# EAGLE design SOL_zSat_camera (EAGLE 9.0.0)
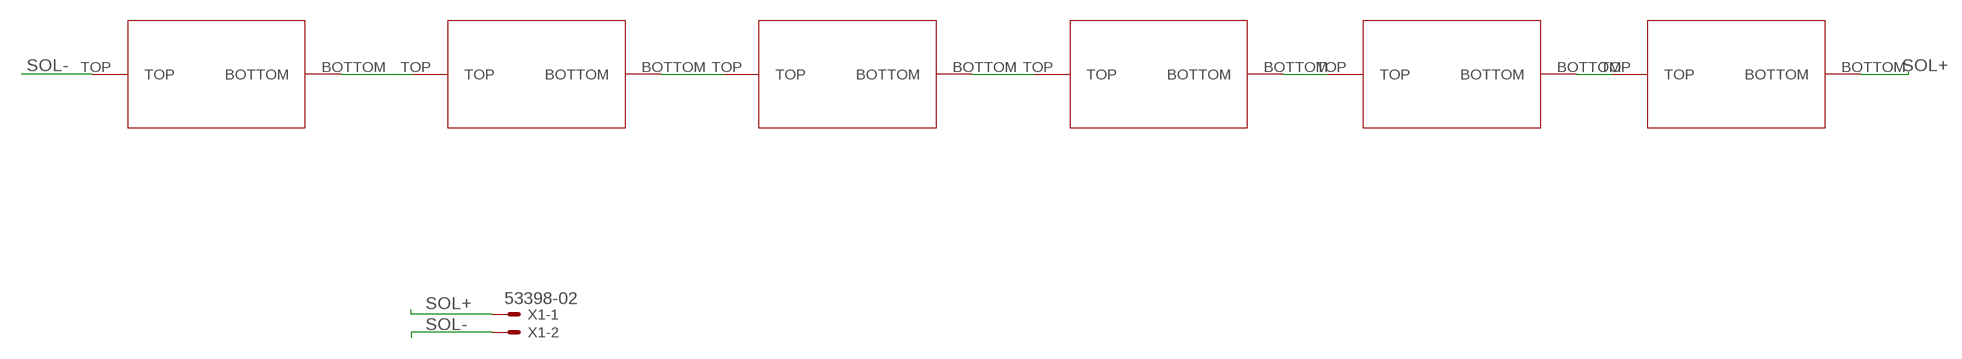
[diagram p0: schematic, sheet 1]

## Parts
U$1  SOL_26X52  [SOLAR_52X26]
U$2  SOL_26X52  [SOLAR_52X26]
U$3  SOL_26X52  [SOLAR_52X26]
U$4  SOL_26X52  [SOLAR_52X26]
U$5  SOL_26X52  [SOLAR_52X26]
U$6  SOL_26X52  [SOLAR_52X26]
X1  53398-02  [53398-02]

## Nets
N$2: U$1.BOTTOM U$2.TOP
N$3: U$2.BOTTOM U$3.TOP
N$4: U$3.BOTTOM U$4.TOP
N$5: U$4.BOTTOM U$5.TOP
N$6: U$5.BOTTOM U$6.TOP
SOL+: U$6.BOTTOM X1.1
SOL-: U$1.TOP X1.2

## Library data of the parts
U$1-U$6 = sil_26x52:SOL_26X52
X1 = con-molex:53?-02: CONNECTOR wire to board 1.25 mm (.049 inch) pitch header; MF: MOLEX; OC_FARNELL: unknown; OC_NEWARK: unknown

## Board
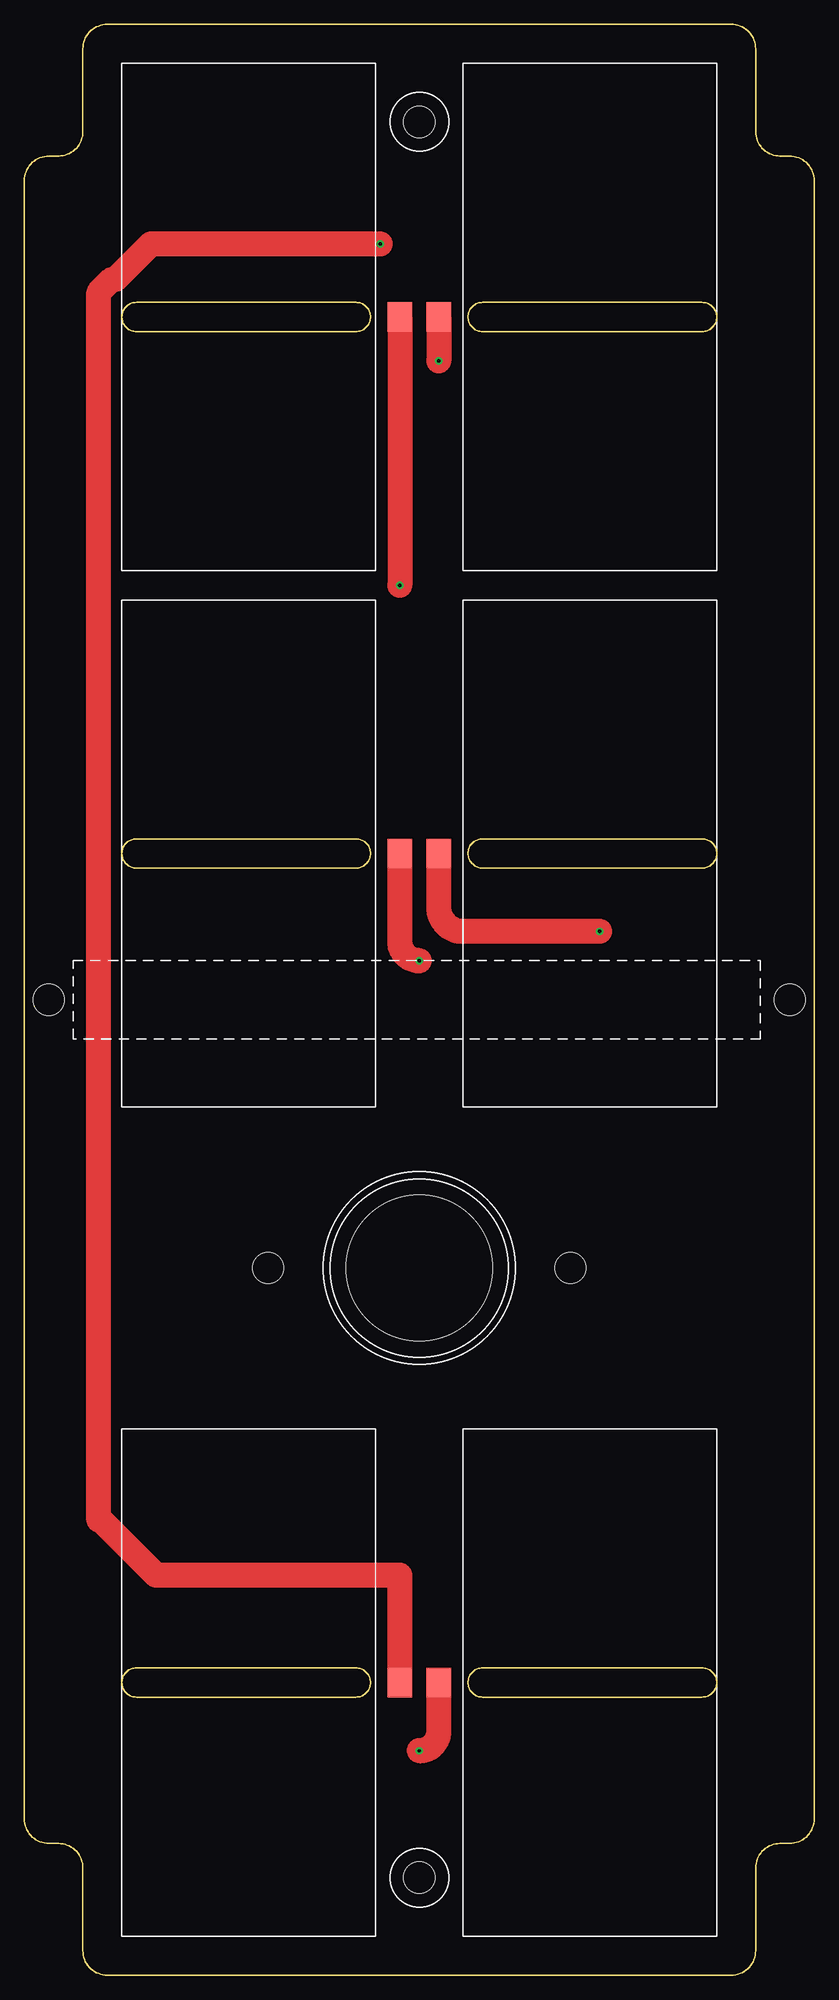
[diagram p1: board, top side]
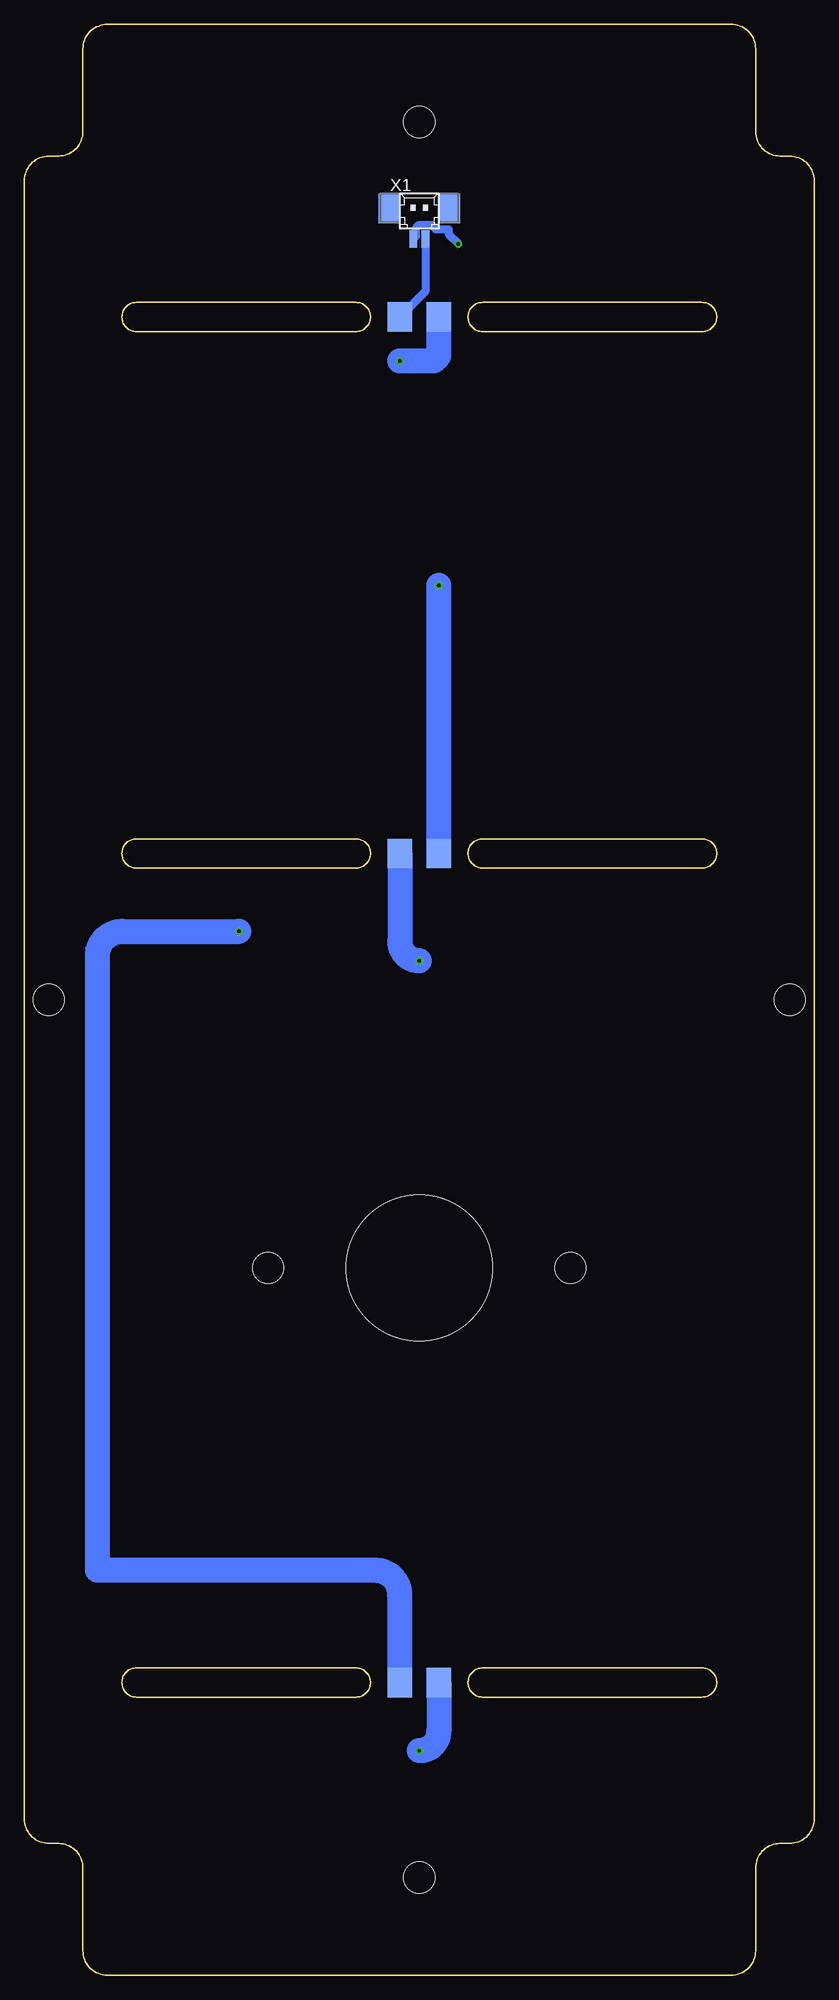
[diagram p2: board, bottom side, seen from below]

Size 81 x 200 mm. Coordinates in mm from the lower left corner, seen from the top.
Outline: 6,11 6,2.5 arc90 8.5,0 72.5,0 arc90 75,2.5 75,11 arc-90 77.5,13.5 78.5,13.5 arc90 81,16 81,184 arc90 78.5,186.5 77.5,186.5 arc-90 75,189 75,197.5 arc90 72.5,200 8.5,200 arc90 6,197.5 6,189 arc-90 3.5,186.5 2.5,186.5 arc90 0,184 0,16 arc90 2.5,13.5 3.5,13.5 arc-90 6,11
Copper layers (1*16): Top 0.035mm / dielectric 1.5mm / Bottom 0.035mm
Design rules "default *": minimum track width 6mil, minimum drill 0.35mm, track to track 6mil, track to pad 6mil, pad to pad 6mil, via to via 6mil, smd to smd 6mil, copper to edge 40mil, drill to drill 6mil, minimum pad ring 10mil, minimum via ring 8mil, stop-mask expansion 4mil, vias tented up to drill 30mil, thermal gap 10mil
Holes 3.2 mm at 2.5,100 78.5,100 40.5,10 40.5,190 56,72.5 25,72.5
Holes 15 mm at 40.5,72.5

### Footprints (pad centres in the part's own frame; a part is rotated, then mirrored left to right if it is on the bottom)
SOLAR_52X26 = smd 3 x 2.5 bottom: BOTTOM 0,28.5 | smd 3 x 2.5: TOP 0,28.5
53398-02 = smd 0.8 x 1.8: 1 0.625,-2.5; 2 -0.625,-2.5 | smd 2.1 x 3: S1 3.125,0.625; S2 -3.125,0.625

### Placement (x,y rotation side)
U$1  10,30 270 top
U$2  71,30 90 top
U$3  71,115 90 top
U$4  10,115 270 top
U$5  10,170 270 top
U$6  71,170 90 top
X1  40.5,180.5 0 bottom

### Tracks (layer width: path | path; a pad name or v marks a point on that pad's centre or on a via)
N$2  (via drill 0.35)
  Top 2.54: v40.5,23 arc90 42.5,25 U$2.TOP
  Bottom 2.54: U$1.BOTTOM 38.5,25 arc90 v40.5,23
N$3  (via drill 0.35)
  Top 2.54: v59,107 45,107 arc-90 42.5,109.5 U$3.TOP
  Bottom 2.54: U$2.BOTTOM 42.5,39 arc-90 45,41.5 73.5,41.5 73.5,104.5 arc90 71,107 v59,107
N$4  (via drill 0.35)
  Top 2.54: v40.5,104 arc-90 38.5,106 U$4.TOP
  Bottom 2.54: U$3.BOTTOM 42.5,106 arc-90 v40.5,104
N$5  (via drill 0.35)
  Top 2.54: U$5.TOP v38.5,142.5
  Bottom 2.54: U$4.BOTTOM v38.5,142.5
N$6  (via drill 0.35)
  Top 2.54: U$6.TOP v42.5,165.5
  Bottom 2.54: v42.5,165.5 39,165.5 38.5,166 U$5.BOTTOM
SOL+
  Bottom 0.813: X1.1 39.88,172.62 U$6.BOTTOM
SOL-  (via drill 0.35)
  Top 0.61: v36.5,177.5 37,178
  Top 2.54: U$1.TOP 38.5,41 13.5,41 8,46.5 7.64,46.64 7.64,172.52 8.98,173.86 9.36,173.86 13,177.5 v36.5,177.5
  Bottom 0.813: X1.2 40.83,178.29 40.83,179.13 40.51,179.46 39.24,179.46 38.78,179 37.5,179 37.5,178.5 v36.5,177.5